# Altium schematic sheet DC-DC_4-36V_2A.SchDoc
size A4
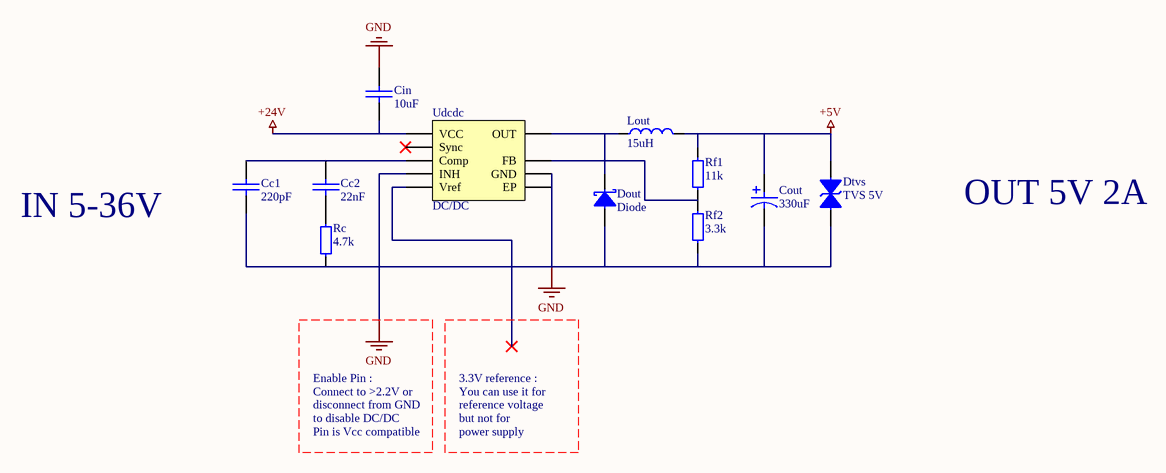
[diagram p0: DC-DC_4-36V_2A.SchDoc]

## Parts
Cc1  220pF  [0603 Capicator]
Cc2  22nF  [0603 Capicator]
Cin  10uF  [1210 CAPACITOR]
Cout  330uF  [Bar Cap 8x10.5]
Dout  Diode  [SMA]
Dtvs  TVS 5V  [sod-323]
Lout  15uH  [Inductor 7x7]
Rc  4.7k  [0603 Resistor]
Rf1  11k  [0603 Resistor]
Rf2  3.3k  [0603 Resistor]
Udcdc  DC/DC  [HSOP-8]

## Nets
+5V: Cout.2 Dtvs.1 Lout.2 Rf1.2
+24V: Cin.1 Udcdc.8(VCC)
GND: Cc1.1 Cin.2 Cout.1 Dout.1 Dtvs.2 Rc.1 Rf2.1 Udcdc.3(INH) Udcdc.7(GND) Udcdc.A(EP)
NetCc1_2: Cc1.2 Cc2.2 Udcdc.4(Comp)
NetCc2_1: Cc2.1 Rc.2
NetDout_2: Dout.2 Lout.1 Udcdc.1(OUT)
NetRf1_1: Rf1.1 Rf2.2 Udcdc.5(FB)

Not connected (* = marked no-connect by the designer): Udcdc 2(Sync)* 6(Vref)*

## Notes on the sheet
- IN 5-36V
- OUT 5V 2A
- Enable Pin :
- Connect to >2.2V or
- disconnect from GND
- 3.3V reference :
- You can use it for
- reference voltage
- to disable DC/DC
- Pin is Vcc compatible
- but not for
- power supply

## Library data of the parts
Cc1 = Cap 220pF (0603): 220pF NP0 50V 5% 0603; Manufacturer: Murata Manufacturing; Part Number: GRM1885C1H221J; Type: Capacitor; ComponentLink1Description: Chip&Dip; ComponentLink1URL: https://www.chipdip.ru/product/grm1885c1h221j
Cc2 = Cap 22nF (0603): 22nF X7R 50V 10% 0603; Manufacturer: Murata Manufacturing; Part Number: GRM188R71H223KA01D; Type: Capacitor; ComponentLink1Description: Chip&Dip; ComponentLink1URL: https://www.chipdip.ru/product/grm188r71h223k
Cin = Cap 10uF (1210): 10uF X7R 10% 50V 1210; Manufacturer: Murata Manufacturing; Part Number: GRM32ER71H106KA12; Type: Capacitor; ComponentLink1Description: Chip&Dip; ComponentLink1URL: https://www.chipdip.ru/product/grm32er71h106k
Cout = Cap Pol 330uF: ECAP SMD,  16V, 105°C, 20%; Part Number: JCK1C331M080105; Manufacturer: JB; Type: Capacitor; ComponentLink1Description: Chip&Dip; ComponentLink1URL: https://www.chipdip.ru/product0/9000565746
Dout = Diode Schottky (SMA): Diode Schottky 3A 40V; Part Number: B340A-E3/61T; Manufacturer: Vishay; Type: Diode; ComponentLink1Description: DataSheet; ComponentLink1URL: https://static.chipdip.ru/lib/652/DOC001652710.pdf; ComponentLink2Description: Chip&Dip; ComponentLink2URL: https://www.chipdip.ru/product/b340a-e3-61t-2
Dtvs = TVS Diode 5V [PESD]: ESD Suppressor TVS 30KV,130W,  SOD-323; Part Number: PESD5V0S1BA,115; Manufacturer: Nexperia; Type: Diode; ComponentLink1Description: DataSheet; ComponentLink1URL: https://static.chipdip.ru/lib/160/DOC001160262.pdf; ComponentLink2Description: Chip&Dip; ComponentLink2URL: https://www.chipdip.ru/product/pesd5v0s1ba.115
Lout = Inductor 15uH (0.2..3.6A): 15uH, 1.53A, 7X7; Part Number: B82472G6153M000; Manufacturer: Epcos; Type: Inductor; ComponentLink1Description: DataSheet; ComponentLink1URL: https://static.chipdip.ru/lib/972/DOC003972643.pdf; ComponentLink2Description: Chip&Dip; ComponentLink2URL: https://www.chipdip.ru/product/b82472g6153m000-15
Rc = Res 4.7k (0603): 0.1W 0603 4.7k, 1%; Part Number: RC0603FR-074K7L; Manufacturer: Taiwan; Type: Resistor; ComponentLink1Description: Chip&Dip; ComponentLink1URL: https://www.chipdip.ru/product0/9000079728
Rf1 = Res 11k (0603): 0.1W 0603 11k, 1%; Part Number: RC0603FR-0711KL; Manufacturer: Taiwan; Type: Resistor; ComponentLink1Description: Chip&Dip; ComponentLink1URL: https://www.chipdip.ru/product0/9000079737
Rf2 = Res 3.3k (0603): 0.1W 0603 3.3k, 1%; Part Number: RC0603FR-073K3L; Manufacturer: Taiwan; Type: Resistor; ComponentLink1Description: Chip&Dip; ComponentLink1URL: https://www.chipdip.ru/product0/9000079724
Udcdc = DC/DC Controller [L5973]: The L5973AD is a step down monolithic power switching regulator with a switch current limit of 2 A so it is able to deliver more than 1.5 A DC current to the load depending on the application conditions; Manufacturer: STMicroelectronics; Part Number: L5973ADTR; ComponentLink1Description: Chip&Dip; ComponentLink1URL: https://www.chipdip.ru/product/l5973ad; ComponentLink2Description: DataSheet; ComponentLink2URL: https://static.chipdip.ru/lib/583/DOC001583165.pdf; Type: IC